# Altium schematic sheet Main.SchDoc
size A4; SheetNumber: 1; SheetTotal: 3
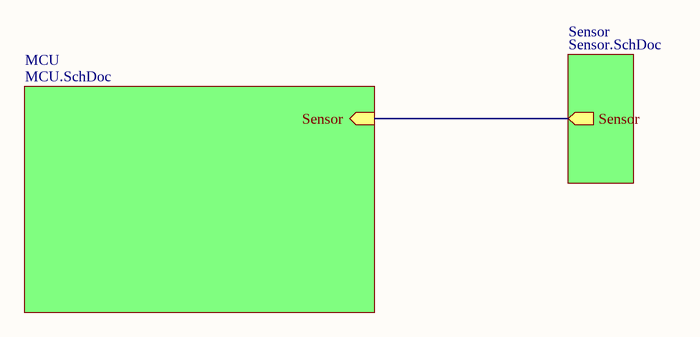
[diagram p0: Main.SchDoc]

## Sub-sheets
MCU = MCU.SchDoc: Sensor (in)
Sensor = Sensor.SchDoc: Sensor (out)

## Nets
(unnamed): sheet MCU/Sensor, sheet Sensor/Sensor